# EAGLE schematic serialEnabled (EAGLE 6.5.0)
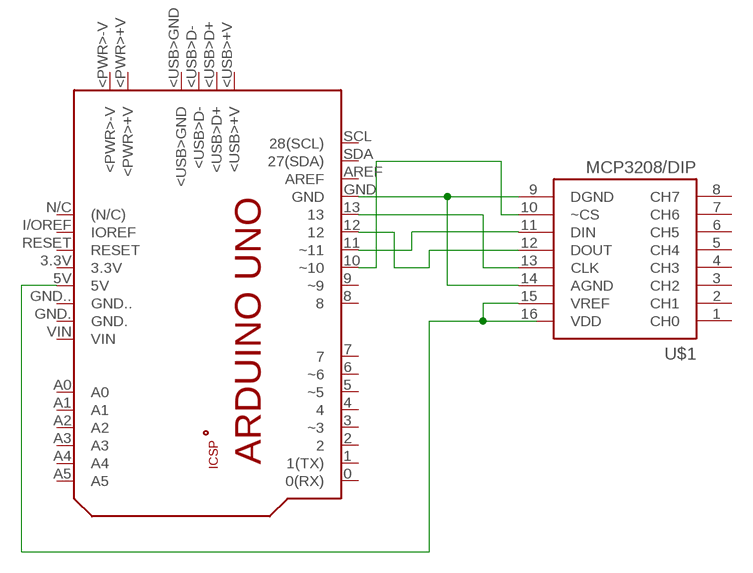
[diagram p0: schematic, sheet 1]

## Parts
PCB1  ARDUINO_UNO  [ARDUINO_UNO]
U$1  MCP3208/DIP  [DIL16]

## Nets
N$1: PCB1.GND U$1.9(DGND) U$1.14(AGND)
N$2: PCB1.11(~11) U$1.11(DIN)
N$3: PCB1.5V U$1.15(VREF)
N$4: PCB1.13 U$1.13(CLK)
N$5: PCB1.12 U$1.12(DOUT)
N$6: PCB1.10(~10) U$1.10(~CS)
Unconnected: PCB1.0(0(RX)) PCB1.1(1(TX)) PCB1.2 PCB1.3(~3) PCB1.3.3V PCB1.4 PCB1.5(~5) PCB1.6(~6) PCB1.7 PCB1.8 PCB1.9(~9) PCB1.+5V PCB1.<PWR>+V PCB1.<PWR>-V PCB1.<USB>+V PCB1.<USB>D+ PCB1.<USB>D- PCB1.<USB>GND PCB1.A0 PCB1.A1 PCB1.A2 PCB1.A3 PCB1.A4 PCB1.A5 PCB1.AREF PCB1.GND. PCB1.GND.. PCB1.GND_ PCB1.I/OREF(IOREF) PCB1.MISO PCB1.MOSI PCB1.N/C((N/C)) PCB1.RESET PCB1.RESET. PCB1.SCK PCB1.SCL(28(SCL)) PCB1.SDA(27(SDA)) PCB1.VIN U$1.1(CH0) U$1.2(CH1) U$1.3(CH2) U$1.4(CH3) U$1.5(CH4) U$1.6(CH5) U$1.7(CH6) U$1.8(CH7) U$1.16(VDD)

## Library data of the parts
PCB1 = E14_Arduino:ARDUINO_UNO: Device for representing an Arduino Uno board with a footprint in an EAGLE design. Created by Dave Young for Element14. More EAGLE documentation at: http://www.element14.com/community/community/knode/cadsoft_eagle
U$1 = mcp3208:MCP3208/DIP